# EAGLE design pinball_outputs_smt (EAGLE 5.11)
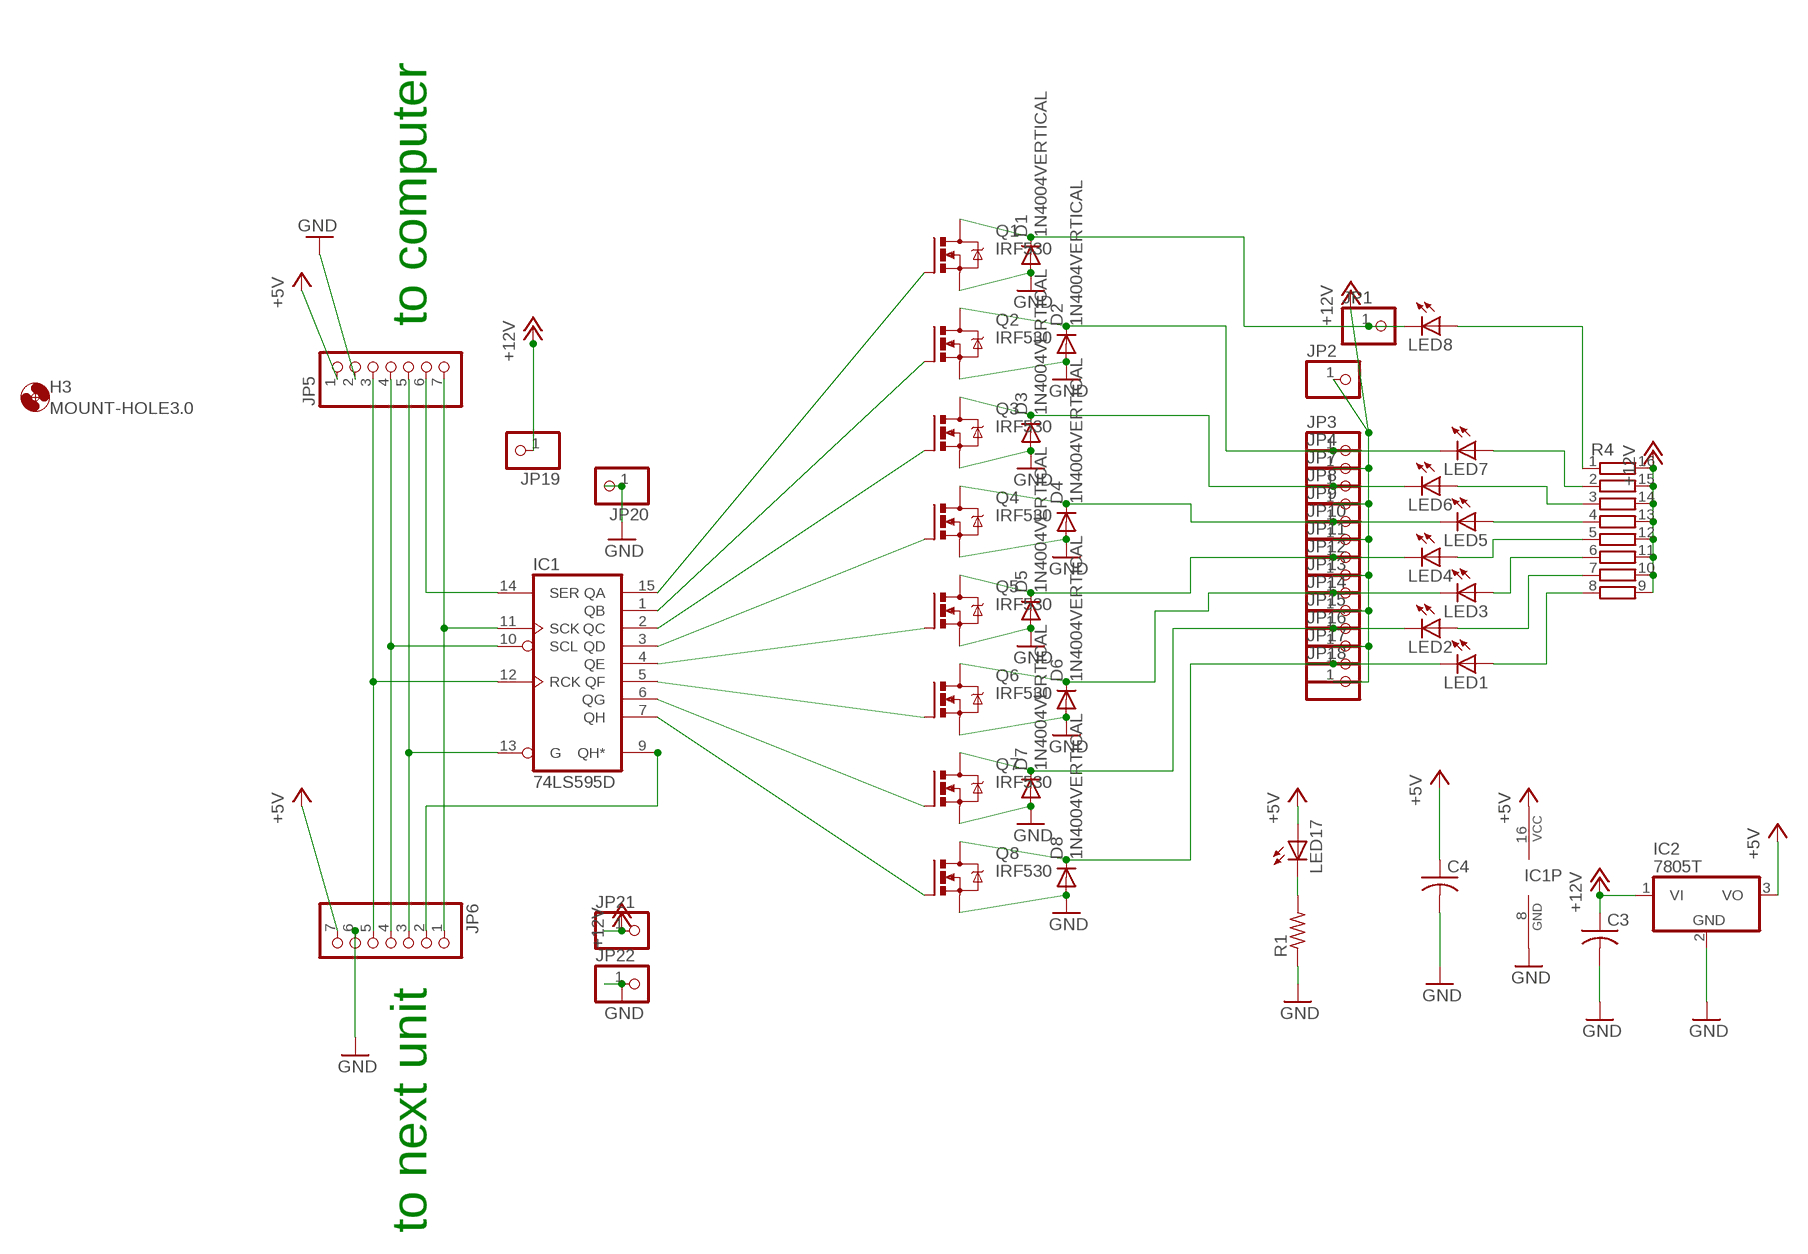
[diagram p0: schematic, sheet 1]

## Parts
C3  C-USC1206  [C1206]
C4  C-USC1206  [C1206]
D1  1N4004VERTICAL  [COMPACT_THROUGH_HOLE]
D2  1N4004VERTICAL  [COMPACT_THROUGH_HOLE]
D3  1N4004VERTICAL  [COMPACT_THROUGH_HOLE]
D4  1N4004VERTICAL  [COMPACT_THROUGH_HOLE]
D5  1N4004VERTICAL  [COMPACT_THROUGH_HOLE]
D6  1N4004VERTICAL  [COMPACT_THROUGH_HOLE]
D7  1N4004VERTICAL  [COMPACT_THROUGH_HOLE]
D8  1N4004VERTICAL  [COMPACT_THROUGH_HOLE]
H3  MOUNT-HOLE3.0  [3,0]
IC1  74LS595D  [SO16]
IC2  7805T  [TO220H]
JP1  PINHD-1X1  [1X01]
JP2  PINHD-1X1  [1X01]
JP3  PINHD-1X1  [1X01]
JP4  PINHD-1X1  [1X01]
JP5  PINHD-1X7/90  [1X07/90]
JP6  PINHD-1X7/90  [1X07/90]
JP7  PINHD-1X1  [1X01]
JP8  PINHD-1X1  [1X01]
JP9  PINHD-1X1  [1X01]
JP10  PINHD-1X1  [1X01]
JP11  PINHD-1X1  [1X01]
JP12  PINHD-1X1  [1X01]
JP13  PINHD-1X1  [1X01]
JP14  PINHD-1X1  [1X01]
JP15  PINHD-1X1  [1X01]
JP16  PINHD-1X1  [1X01]
JP17  PINHD-1X1  [1X01]
JP18  PINHD-1X1  [1X01]
JP19  PINHD-1X1  [1X01]
JP20  PINHD-1X1  [1X01]
JP21  PINHD-1X1  [1X01]
JP22  PINHD-1X1  [1X01]
LED1  LEDSMT1206  [1206]
LED2  LEDSMT1206  [1206]
LED3  LEDSMT1206  [1206]
LED4  LEDSMT1206  [1206]
LED5  LEDSMT1206  [1206]
LED6  LEDSMT1206  [1206]
LED7  LEDSMT1206  [1206]
LED8  LEDSMT1206  [1206]
LED17  LEDSMT1206  [1206]
Q1  IRF530  [TO220BV]
Q2  IRF530  [TO220BV]
Q3  IRF530  [TO220BV]
Q4  IRF530  [TO220BV]
Q5  IRF530  [TO220BV]
Q6  IRF530  [TO220BV]
Q7  IRF530  [TO220BV]
Q8  IRF530  [TO220BV]
R1  R-US_M1206  [M1206]
R4  2NBS16-8  [SO16]

## Nets
+5V [power]: C4.1 IC1.16(VCC) IC2.3(VO) JP5.1 JP6.7 LED17.A
+12V [hivolts]: C3.1 IC2.1(VI) JP2.1 JP4.1 JP8.1 JP10.1 JP12.1 JP14.1 JP16.1 JP18.1 JP19.1 JP21.1 R4.9 R4.10 R4.11 R4.12 R4.13 R4.14 R4.15 R4.16
GND [hivolts]: C3.2 C4.2 D1.P$1(A) D2.P$1(A) D3.P$1(A) D4.P$1(A) D5.P$1(A) D6.P$1(A) D7.P$1(A) D8.P$1(A) IC1.8(GND) IC2.2(GND) JP5.2 JP6.6 JP20.1 JP22.1 Q1.S Q2.S Q3.S Q4.S Q5.S Q6.S Q7.S Q8.S R1.1
N$1: IC1.14(SER) JP5.6
N$9: LED17.C R1.2
N$11: IC1.15(QA) Q1.G
N$12: IC1.1(QB) Q2.G
N$13: IC1.2(QC) Q3.G
N$14: IC1.3(QD) Q4.G
N$15: IC1.4(QE) Q5.G
N$16: IC1.5(QF) Q6.G
N$17: IC1.6(QG) Q7.G
N$20 [hivolts]: D1.P$2(C) JP1.1 LED8.C Q1.D
N$22 [hivolts]: D2.P$2(C) JP3.1 LED7.C Q2.D
N$24 [hivolts]: D3.P$2(C) JP7.1 LED6.C Q3.D
N$26 [hivolts]: D4.P$2(C) JP9.1 LED5.C Q4.D
N$28 [hivolts]: D5.P$2(C) JP11.1 LED4.C Q5.D
N$29: LED8.A R4.1
N$30 [hivolts]: D6.P$2(C) JP13.1 LED3.C Q6.D
N$31: LED7.A R4.2
N$32 [hivolts]: D7.P$2(C) JP15.1 LED2.C Q7.D
N$33: LED6.A R4.3
N$34 [hivolts]: D8.P$2(C) JP17.1 LED1.C Q8.D
N$35: LED5.A R4.4
N$36: LED4.A R4.5
N$37: LED3.A R4.6
N$38: LED2.A R4.7
N$39: LED1.A R4.8
N$46: IC1.11(SCK) JP5.7 JP6.1
N$47: IC1.13(G) JP5.5 JP6.3
N$48: IC1.10(SCL) JP5.4 JP6.4
N$49: IC1.12(RCK) JP5.3 JP6.5
N$50: IC1.9(QH*) JP6.2
N$53: IC1.7(QH) Q8.G

## Notes on the sheet
- to computer
- to next unit

## Library data of the parts
C3 C4 = rcl:C-US: CAPACITOR, American symbol
D1-D8 = diode:1N4004: DIODE general purpose rectifier, 1 A
H3 = holes:MOUNT-HOLE: MOUNTING HOLE with drill center marker
IC1 = 74xx-us:74*595: 8-bit SHIFT REGISTER, output latch
IC2 = linear:78*: Positive VOLTAGE REGULATOR Source: http://cache.national.com/ds/LM/LM78L05.pdf http://www.fairchildsemi.com/ds/LM/LM7805.pdf
JP1-JP4 JP7-JP22 = pinhead:PINHD-1X1: PIN HEADER
JP5 JP6 = pinhead:PINHD-1X7: PIN HEADER
LED1-LED8 LED17 = led:LED: LED OSRAM: - CHIPLED LG R971, LG N971, LY N971, LG Q971, LY Q971, LO R971, LY R971 LH N974, LH R974 LS Q976, LO Q976, LY Q976 LO Q996 - Hyper CHIPLED LW Q18S LB Q993, LB Q99A, LB R99A - SideLED LS A670, LO A670, LY A670, LG A670, LP A670 LB A673, LV A673, LT A673, LW A673 LH A674 LY A675 LS A676, LA A676, LO A676, LY A676, LW A676 LS A679, LY A679, LG A679 - Hyper Micro SIDELED® LS Y876, LA Y876, LO Y876, LY Y876 LT Y87S - SmartLED LW L88C, LW L88S LB L89C, LB L89S, LG L890 LS L89K, LO L89K, LY L89K LS L896, LA L896, LO L896, LY L896 - TOPLED LS T670, LO T670, LY T670, LG T670, LP T670 LSG T670, LSP T670, LSY T670, LOP T670, LYG T670 LG T671, LOG T671, LSG T671 LB T673, LV T673, LT T673, LW T673 LH T674 LS T676, LA T676, LO T676, LY T676, LB T676, LH T676, LSB T676, LW T676 LB T67C, LV T67C, LT T67C, LS T67K, LO T67K, LY T67K, LW E67C LS E67B, LA E67B, LO E67B, LY E67B, LB E67C, LV E67C, LT E67C LW T67C LS T679, LY T679, LG T679 LS T770, LO T770, LY T770, LG T770, LP T770 LB T773, LV T773, LT T773, LW T773 LH T774 LS E675, LA E675, LY E675, LS T675 LS T776, LA T776, LO T776, LY T776, LB T776 LHGB T686 LT T68C, LB T68C - Hyper Mini TOPLED® LB M676 - Mini TOPLED Santana® LG M470 LS M47K, LO M47K, LY M47K Source: http://www.osram.convergy.de LUXEON: - LUMILED® LXK2-PW12-R00, LXK2-PW12-S00, LXK2-PW14-U00, LXK2-PW14-V00 LXK2-PM12-R00, LXK2-PM12-S00, LXK2-PM14-U00 LXK2-PE12-Q00, LXK2-PE12-R00, LXK2-PE12-S00, LXK2-PE14-T00, LXK2-PE14-U00 LXK2-PB12-K00, LXK2-PB12-L00, LXK2-PB12-M00, LXK2-PB14-N00, LXK2-PB14-P00, LXK2-PB14-Q00 LXK2-PR12-L00, LXK2-PR12-M00, LXK2-PR14-Q00, LXK2-PR14-R00 LXK2-PD12-Q00, LXK2-PD12-R00, LXK2-PD12-S00 LXK2-PH12-R00, LXK2-PH12-S00 LXK2-PL12-P00, LXK2-PL12-Q00, LXK2-PL12-R00 Source: www.luxeon.com KINGBRIGHT: KA-3528ASYC Source: www.kingbright.com
Q1-Q8 = transistor-power:IRF530: HEXFET Power MOSFET
R1 = resistor:R-US_: RESISTOR, American symbol
R4 = resistor-bourns:2NBS16-8: BOURNS RESISTOR NETWORK

## Net classes
0 default: width 0.254 mm, drill 0.381 mm, clearance 0.203 mm
1 power: width 0.508 mm, drill 0.508 mm, clearance 0.254 mm
2 hivolts: width 1.016 mm, drill 0.762 mm, clearance 0.508 mm

## Board
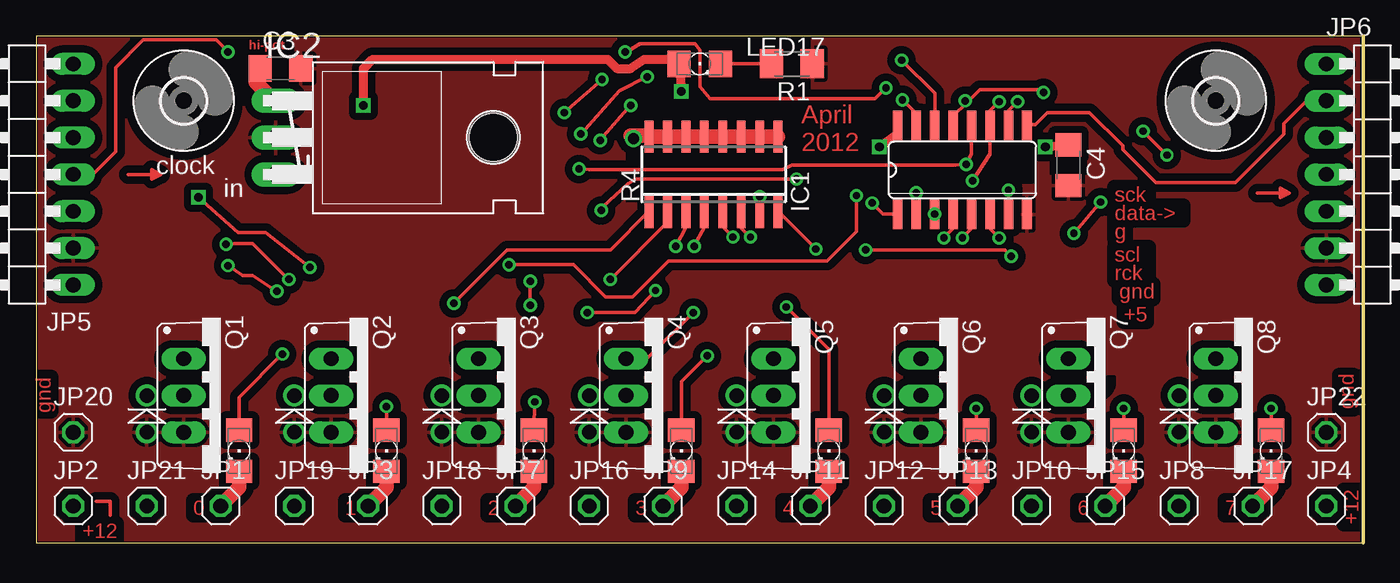
[diagram p1: board, top side]
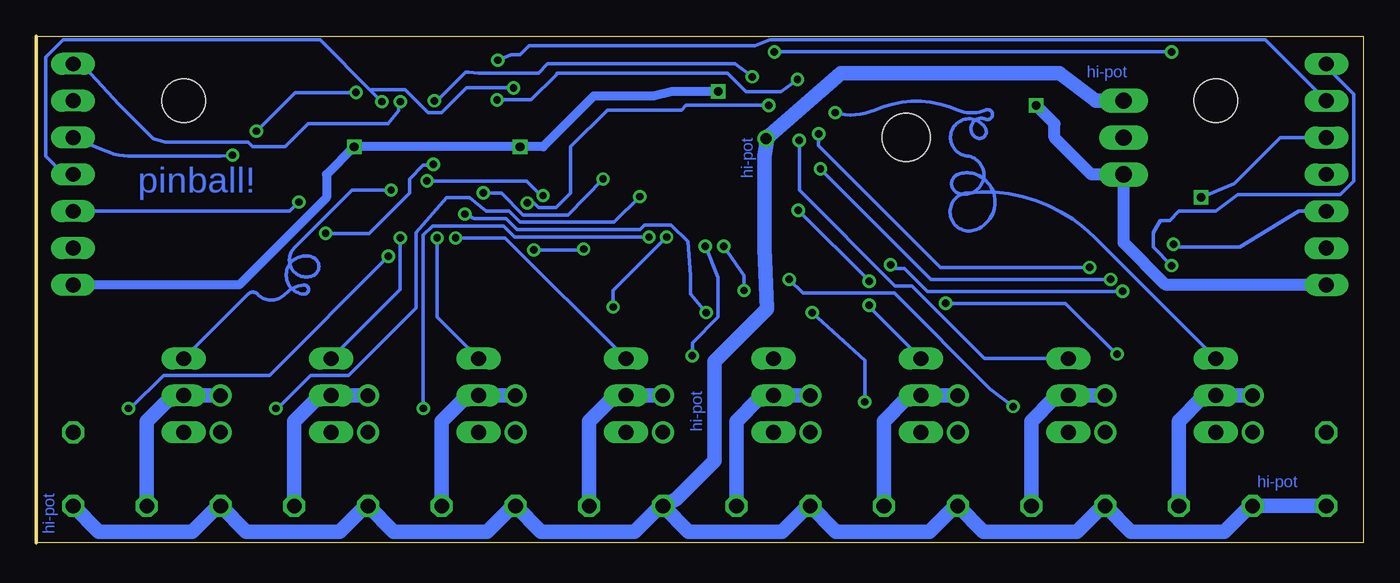
[diagram p2: board, bottom side, seen from below]

Size 91.44 x 34.92 mm. Coordinates in mm from the lower left corner, seen from the top.
Outline: 0,0 91.44,0 91.44,34.92 0,34.92 0,0
Copper layers (1*16): Top 0.035mm / dielectric 1.5mm / Bottom 0.035mm
Design rules "default *": minimum track width 8mil, minimum drill 20mil, track to track 8mil, track to pad 8mil, pad to pad 8mil, via to via 8mil, smd to smd 0mil, copper to edge 4mil, drill to drill 7mil, minimum pad ring 10mil, minimum via ring 8mil, stop-mask expansion 4mil, vias tented up to drill 0mil, thermal gap 10mil
tRestrict: area 71.8,9.8 to 74.3,11.4; area 43.8,30.5 to 53.3,35.6; area 40.6,23.5 to 43.2,27.9; area 69.8,25.4 to 72.4,28.6; area 15.2,31.7 to 17.8,34.3; area 66.4,24.8 to 68.9,27.3
vRestrict: area 19,22.9 to 34.9,33

### Footprints (pad centres in the part's own frame; a part is rotated, then mirrored left to right if it is on the bottom)
C1206 = smd 1.6 x 1.8: 1 -1.4,0; 2 1.4,0
COMPACT_THROUGH_HOLE = drill 1 round: P$1 -1.27,0; P$2 1.27,0
3,0 = hole 3: 0,0
SO16 = smd 0.66 x 2.032: 1 -4.445,-3.073; 2 -3.175,-3.073; 3 -1.905,-3.073; 4 -0.635,-3.073; 5 0.635,-3.073; 6 1.905,-3.073; 7 3.175,-3.073; 8 4.445,-3.073; 9 4.445,3.073; 10 3.175,3.073; 11 1.905,3.073; 12 0.635,3.073; 13 -0.635,3.073; 14 -1.905,3.073; 15 -3.175,3.073; 16 -4.445,3.073
TO220H = drill 1.118 long: 1 -2.54,-10.16; 2 0,-10.16; 3 2.54,-10.16 | hole 3.302: 0,4.826
1X01 = drill 1.016 octagon: 1 0,0
1X07/90 = drill 1.016 long: 1 -7.62,-3.81; 2 -5.08,-3.81; 3 -2.54,-3.81; 4 0,-3.81; 5 2.54,-3.81; 6 5.08,-3.81; 7 7.62,-3.81
1206 = smd 1.6 x 1.803: A -1.422,0; C 1.422,0
TO220BV = drill 1.016 long: D 0,-2.54; G -2.54,-2.54; S 2.54,-2.54
M1206 = smd 1.6 x 2: 1 -1.4,0; 2 1.4,0
SO16' = smd 0.6 x 2.2: 1 -4.445,-2.6; 2 -3.175,-2.6; 3 -1.905,-2.6; 4 -0.635,-2.6; 5 0.635,-2.6; 6 1.905,-2.6; 7 3.175,-2.6; 8 4.445,-2.6; 9 4.445,2.6; 10 3.175,2.6; 11 1.905,2.6; 12 0.635,2.6; 13 -0.635,2.6; 14 -1.905,2.6; 15 -3.175,2.6; 16 -4.445,2.6

### Placement (x,y rotation side)
C3  16.83,32.7 0 top
C4  71.12,26.04 270 top
D1  7.62,8.89 90 top
D2  17.78,8.89 90 top
D3  27.94,8.89 90 top
D4  38.1,8.89 90 top
D5  48.26,8.89 90 top
D6  58.42,8.89 90 top
D7  68.58,8.89 90 top
D8  78.74,8.89 90 top
H3  81.28,30.48 0 top
H4  MOUNT-HOLE3.0  [3,0]  10.16,30.48 0 top
IC1  63.82,25.72 0 top
IC2  26.67,27.94 270 top
JP1  12.7,2.54 0 top
JP2  2.54,2.54 0 top
JP3  22.86,2.54 0 top
JP4  88.9,2.54 0 top
JP5  -1.27,25.4 90 top
JP6  92.71,25.4 270 top
JP7  33.02,2.54 0 top
JP8  78.74,2.54 0 top
JP9  43.18,2.54 0 top
JP10  68.58,2.54 0 top
JP11  53.34,2.54 0 top
JP12  58.42,2.54 0 top
JP13  63.5,2.54 0 top
JP14  48.26,2.54 0 top
JP15  73.66,2.54 0 top
JP16  38.1,2.54 0 top
JP17  83.82,2.54 0 top
JP18  27.94,2.54 0 top
JP19  17.78,2.54 0 top
JP20  2.54,7.62 0 top
JP21  7.62,2.54 0 top
JP22  88.9,7.62 0 top
LED1  85.09,6.35 270 top
LED2  74.93,6.35 270 top
LED3  64.77,6.35 270 top
LED4  54.61,6.35 270 top
LED5  44.45,6.35 270 top
LED6  34.29,6.35 270 top
LED7  24.13,6.35 270 top
LED8  13.97,6.35 270 top
LED17  45.72,33.02 0 top
Q1  12.7,10.16 270 top
Q2  22.86,10.16 270 top
Q3  33.02,10.16 270 top
Q4  43.18,10.16 270 top
Q5  53.34,10.16 270 top
Q6  63.5,10.16 270 top
Q7  73.66,10.16 270 top
Q8  83.82,10.16 270 top
R1  52.07,33.02 180 top
R4  [SO16']  46.67,25.4 0 top

### Tracks (layer width: path | path; a pad name or v marks a point on that pad's centre or on a via)
+5V  (via drill 0.6)
  Top 0.61: v69.53,27.3 C4.1 | v58.1,27.3 59.37,28.26 IC1.16 | v44.45,31.11 LED17.A 43.5,33.34 41.91,33.34 40.96,32.7 40.01,32.7 39.37,33.34 23.18,33.34 22.54,32.7 v22.54,30.16
  Bottom 0.61: JP6.7 77.47,17.78 71.44,23.81 71.44,25.4 v69.53,27.3 v58.1,27.3 56.52,27.3 53.02,30.8 48.9,30.8 47.62,31.11 v44.45,31.11
  Bottom 0.813: JP5.1 13.59,17.78 16.51,20.7 IC2.3 18.73,25.4 21.27,27.94 21.27,28.89 v22.54,30.16
+12V  (via drill 0.76)
  Top 1.016: IC2.1 16.38,30.48 15.11,31.75 15.11,33.02 C3.1 | R4.16 R4.15 | R4.16 | R4.15 | R4.14 | R4.15 R4.14 | R4.13 | R4.14 R4.13 | R4.12 | R4.13 R4.12 | R4.11 | R4.12 R4.11 | R4.10 | R4.11 R4.10 | R4.9 50.8,28 R4.10 | v41.15,27.88 40.96,28.07 41.78,28.07 R4.16
  Bottom 1.016: IC2.1 18.41,30.48 20.95,32.38 36.01,32.38 v41.15,27.88 41.08,27.75 41.27,26.67 41.27,20.32 41.08,16.13 44.7,12.51 44.7,5.65 47.37,2.98 JP14.1 | JP2.1 JP21.1 8.06,2.29 9.59,0.76 16,0.76 JP19.1 18.22,2.29 19.75,0.76 26.16,0.76 JP18.1 28.38,2.29 29.91,0.76 36.32,0.76 JP16.1 38.54,2.29 40.07,0.76 46.48,0.76 JP14.1 | JP14.1 48.7,2.29 50.23,0.76 56.64,0.76 JP12.1 58.86,2.29 60.39,0.76 66.8,0.76 JP10.1 69.03,2.29 70.55,0.76 76.96,0.76 JP8.1 79.18,2.29 80.71,0.76 87.12,0.76 JP4.1
GND
  pour Top: 92.39,-1.59 -0.64,-1.59 -0.64,35.24 93.03,35.56
N$1  (via drill 0.51)
  Top 0.254: v59.63,33.27 61.91,30.99 IC1.14
  Bottom 0.254: v59.63,33.27 58.74,33.66 58.1,33.66 57.47,34.29 41.91,34.29 40.89,34.67 6.73,34.67 JP5.6
N$2
  Top 0.254: 5.08,1.91 5.08,2.86 4.13,2.86
N$3
  Top 0.254: 8.57,25.4 6.35,25.4 | 8.57,25.4 7.94,25.72 7.94,25.08 8.57,25.4
N$4
  Top 0.254: 86.36,24.13 84.14,24.13 | 86.36,24.13 85.72,24.45 85.72,23.81 86.36,24.13
N$9
  Top 0.254: LED17.C R1.2
N$11  (via drill 0.51)
  Top 0.254: v59.69,30.54 60.64,29.59 IC1.15 | v36.39,29.65 v38.99,31.94
  Bottom 0.254: v59.69,30.54 57.34,30.54 55.63,32.26 55.56,32.38 43.81,32.38 42.55,31.11 40.13,31.11 v38.99,31.94 | Q1.G 18.54,21.08 arc-52 27.3,24.13 arc-195 26.67,21.59 arc-137 26.67,25.4 arc-43 27.94,25.4 arc-137 27.94,24.13 arc-195 27.3,26.67 arc234 26.04,28.57 arc149 26.67,27.94 arc175 26.04,29.21 arc-228 26.04,29.84 arc48 27.94,29.84 arc-48 33.66,29.84 arc40 v36.39,29.65
N$12  (via drill 0.51)
  Top 0.254: v57.59,23.43 58.36,22.67 59.37,22.67 IC1.1 | v38.86,27.75 v40.96,30.16
  Bottom 0.254: v57.59,23.43 57.15,23.43 56.83,23.11 55.63,23.11 54.61,24.13 54.61,27.3 52.07,29.84 46.99,29.84 46.67,30.16 v40.96,30.16 | v38.86,27.75 38.86,24.32 32.26,17.72 31.11,17.72 26.1,12.7 Q2.G
N$13  (via drill 0.51)
  Top 0.254: v52.39,25.08 41.27,25.08 40.7,24.7 40.77,24.77 39.05,23.18 v38.92,22.92 | v34.04,16.38 v34.04,18.03 | v60.64,24.13 IC1.2
  Bottom 0.254: v60.64,24.13 59.37,24.13 57.91,22.61 54.8,22.61 v52.39,25.08 | v52.39,25.08 52.32,25.08 | v52.39,25.08 52.64,25.08 | v34.04,18.03 v38.92,22.92 | v34.04,16.38 34.04,16.26 Q3.G
N$14  (via drill 0.51)
  Top 0.254: v45.28,15.88 42.1,12.7 Q4.G | v61.91,22.67 IC1.3
  Bottom 0.254: v61.91,22.67 61.28,22.35 59.05,22.35 58.29,21.59 49.85,21.59 49.53,21.91 47.69,21.91 46.55,20.77 46.35,18.41 46.35,17.14 v45.28,15.88
N$15  (via drill 0.51)
  Top 0.254: v62.55,21.02 63.18,21.65 IC1.4
  Bottom 0.254: v62.55,21.02 59.12,21.02 Q5.G
N$16  (via drill 0.51)
  Top 0.254: v63.82,21.02 64.45,21.65 IC1.5
  Bottom 0.254: v63.82,21.02 63.82,15.56 Q6.G
N$17  (via drill 0.51)
  Top 0.254: v66.36,21.02 65.72,21.65 IC1.6
  Bottom 0.254: v66.36,21.02 66.36,17.46 Q7.G
N$20
  Top 1.016: JP1.1 13.97,3.81 LED8.C
  Bottom 1.016: D1.P$2 Q1.D 10.6,9.91 11.18,9.91 12.7,8.38 JP1.1
N$22
  Top 1.016: JP3.1 24.13,3.81 LED7.C
  Bottom 1.016: D2.P$2 Q2.D 20.77,9.91 21.34,9.91 22.86,8.38 JP3.1
N$24
  Top 1.016: JP7.1 34.29,3.81 LED6.C
  Bottom 1.016: D3.P$2 Q3.D 30.92,9.91 31.5,9.91 33.02,8.38 JP7.1
N$26
  Top 1.016: JP9.1 44.45,3.81 LED5.C
  Bottom 1.016: D4.P$2 Q4.D 41.08,9.91 41.66,9.91 43.18,8.38 JP9.1
N$28
  Top 1.016: JP11.1 54.61,3.81 LED4.C
  Bottom 1.016: D5.P$2 Q5.D 51.24,9.91 51.82,9.91 53.34,8.38 JP11.1
N$29  (via drill 0.51)
  Top 0.254: v16.95,13.02 13.97,10.03 LED8.A | v28.77,16.51 32.45,20.19 39.56,20.19 42.23,22.86 R4.1
  Bottom 0.254: v16.95,13.02 17.02,13.02 20.51,16.51 v28.77,16.51
N$30
  Top 1.016: JP13.1 64.77,3.81 LED3.C
  Bottom 1.016: D6.P$2 Q6.D 61.4,9.91 61.98,9.91 63.5,8.38 JP13.1
N$31  (via drill 0.51)
  Top 0.254: v39.56,18.16 43.5,22.1 R4.2 | LED7.A v24.13,9.4
  Bottom 0.254: v24.13,9.4 25.72,10.6 32.32,17.21 38.61,17.21 v39.56,18.16
N$32
  Top 1.016: JP15.1 74.93,3.81 LED2.C
  Bottom 1.016: D7.P$2 Q7.D 71.56,9.91 72.14,9.91 73.66,8.38 JP15.1
N$33  (via drill 0.51)
  Top 0.254: v34.35,9.72 34.29,7.81 LED6.A | v37.97,15.88 41.27,15.88 v42.67,17.4 | v44.07,20.45 44.77,21.78 R4.3
  Bottom 0.254: v34.35,9.72 34.35,12.57 v37.97,15.88 | v42.67,17.4 42.67,18.41 v44.07,20.45
N$34
  Top 1.016: JP17.1 85.09,3.81 LED1.C
  Bottom 1.016: D8.P$2 Q8.D 81.72,9.91 82.3,9.91 83.82,8.38 JP17.1
N$35  (via drill 0.51)
  Top 0.254: LED5.A 44.45,11.11 v46.23,12.89 | v45.34,20.45 46.04,21.78 R4.4
  Bottom 0.254: v46.23,12.89 46.23,13.78 44.45,15.56 44.45,18.29 v45.34,20.45
N$36  (via drill 0.51)
  Top 0.254: v51.69,16.26 54.61,13.34 LED4.A | v48.01,21.08 47.31,21.78 R4.5
  Bottom 0.254: v51.69,16.26 51.69,17.4 v48.01,21.08
N$37  (via drill 0.51)
  Top 0.254: v49.21,21.08 48.58,21.72 R4.6 | v64.77,9.27 LED3.A
  Bottom 0.254: v64.77,9.27 64.77,21.21 64.14,21.84 59.24,21.84 58.48,21.08 v49.21,21.08
N$38  (via drill 0.51)
  Top 0.254: v74.93,9.27 LED2.A | R4.7 v49.85,23.88
  Bottom 0.254: v74.93,9.27 74.8,9.27 72.52,11.56 69.91,11.56 65.28,16.19 65.28,21.4 63.18,23.81 61.59,23.81 60.45,22.86 58.86,22.86 58.1,22.1 51.63,22.1 v49.85,23.88
N$39  (via drill 0.51)
  Top 0.254: v67.18,19.75 66.74,20.19 v57.15,20.19 | v53.72,20.26 51.12,22.86 R4.8 | v85.09,9.27 LED1.A
  Bottom 0.254: v85.09,9.27 84.96,9.27 82.68,11.56 75.37,11.56 v67.18,19.75 | v57.15,20.19 53.78,20.19 v53.72,20.26
N$46  (via drill 0.51)
  Top 0.254: v66.36,30.42 65.72,29.78 IC1.11 65.72,26.8 v64.52,24.96 | v13.21,19.11 14.22,18.41 14.92,18.41 v16.57,17.34 | v32.58,19.18 37.02,19.18 39.24,16.95 41.08,16.95 43.56,19.43 54.48,19.43 56.52,21.46 v56.52,23.94
  Bottom 0.254: v66.36,30.42 66.48,30.42 66.48,29.78 67.18,28.89 72.71,28.89 74.3,27.3 76.52,27.3 76.83,27.62 82.55,27.62 83.38,27.88 85.72,30.23 88.9,33.66 JP6.1 | v13.21,19.11 14.48,20.38 14.48,21.4 13.97,22.23 13.34,22.23 12.7,22.86 10.16,22.86 8.64,24 1.59,24 0.64,24.96 0.64,30.92 2.54,32.83 JP5.7 | v16.57,17.34 30.04,17.34 31.62,18.92 32.32,18.92 v32.58,19.18 | v56.52,23.94 56.64,23.94 57.66,24.96 v64.52,24.96
N$47  (via drill 0.51, 0.6)
  Top 0.254: 64.14,30.35 65.02,31.24 69.22,31.24 v69.41,31.05 | 64.14,30.35 63.18,29.4 IC1.13 | v76.26,28.38 v77.92,26.73 | v11.18,23.81 13.91,21.4 15.81,21.4 v18.86,18.99 | v37.53,28.19 40.2,31.18 v42.1,32.13 | v64.01,30.48 64.14,30.35
  Bottom 0.254: v69.41,31.05 73.6,31.05 v76.26,28.38 | v77.92,26.73 78.74,26.67 85.09,26.67 arc24 86.74,27.05 JP6.3 | v11.18,23.81 8.89,24.77 5.71,27.94 JP5.5 | v18.86,18.99 29.15,18.99 37.53,27.37 v37.53,28.19 | v42.1,32.13 43.31,33.02 44.13,33.02 56.2,33.02 56.83,32.38 60.96,32.38 61.66,32.45 61.85,32.45 63.82,30.48 v64.01,30.48
N$48  (via drill 0.51)
  Top 0.254: v67.63,30.42 66.99,29.78 IC1.10 | v13.21,33.85 12.38,34.67 7.37,34.67 5.46,32.77 5.46,26.99 3.87,25.4 JP5.4 | v40.58,33.85 40.7,33.85 41.59,34.42 45.4,34.42 45.72,33.97 45.72,31.43 46.42,30.61 57.78,30.61 v58.55,31.37
  Bottom 0.254: 68.39,31.18 71.88,34.67 89.6,34.67 90.81,33.47 90.81,26.67 89.53,25.4 JP6.4 | 68.39,31.18 v67.63,30.42 | v13.21,33.85 v40.58,33.85 | v58.55,31.37 61.78,31.37 63.5,29.65 64.45,29.65 66.04,31.24 68.33,31.24 68.39,31.18
N$49  (via drill 0.51)
  Top 0.254: v71.5,21.34 v73.34,23.5 | IC1.12 64.45,26.8 v64.07,26.1 63.69,26.16 64.14,26.16 63.88,26.1 arc-7 62.23,26.04 52.07,26.04 51.44,25.72 38.1,25.72 v37.4,25.78 | v13.08,20.57 13.65,20.64 14.92,20.64 v17.4,18.16
  Bottom 0.254: v64.07,26.1 64.14,26.04 64.77,26.04 65.72,25.08 65.72,24.13 68.52,21.34 v71.5,21.34 | v13.08,20.57 12.64,20.38 8.51,20.38 4.45,22.86 JP5.3 | v17.4,18.16 29.78,18.16 v37.4,25.78 | v73.34,23.5 73.98,22.86 JP6.5
N$50
  Top 0.254: JP6.2 87.57,30.48 85.98,28.89 85.98,28.19 82.61,24.83 77.15,24.83 74.87,27.11 74.87,27.37 72.58,29.65 69.66,29.65 68.83,28.83 68.26,28.83 IC1.9
N$53  (via drill 0.51)
  Top 0.254: IC1.7 v66.99,24.32
  Bottom 0.254: v66.99,24.32 69.66,24.32 73.66,20.32 arc-157 72.39,18.41 arc-135 72.39,19.68 arc-197 73.03,17.14 arc-191 73.03,17.78 arc-42 74.3,17.14 arc95 76.2,17.14 arc-95 76.83,17.14 Q8.G

### Text on the board
Top: hi-pot | April | 2012 | sck | data-> | g | scl | rck | gnd | +5 | gnd | gnd | 0 | 1 | 2 | 3 | 4 | 5 | 6 | 7 | +12 | +12
Bottom: hi-pot | hi-pot | pinball! | hi-pot | hi-pot | hi-pot
tNames: clock | in